# EAGLE design OXCLPC (EAGLE 9.5.2)
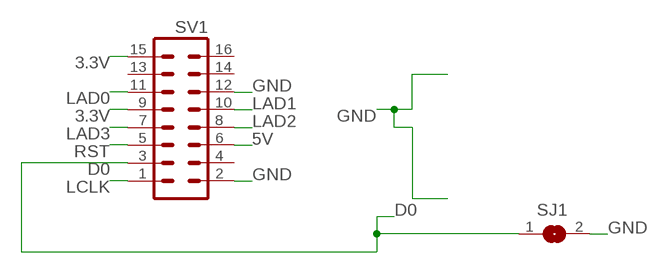
[diagram p0: schematic, sheet 1]

## Parts
SJ1  SJ  [SJ]
SV1  MA08-2  [MA08-2]

## Nets
3.3V: SV1.9 SV1.15
5V: SV1.6
D0: SJ1.1 SV1.3
GND: SJ1.2 SV1.2 SV1.12
LAD0: SV1.11
LAD1: SV1.10
LAD2: SV1.8
LAD3: SV1.7
LCLK: SV1.1
RST: SV1.5
Unconnected: SV1.4 SV1.13 SV1.14 SV1.16

## Library data of the parts
SJ1 = jumper:SJ: SMD solder JUMPER
SV1 = adapter8784:MA08-2: PIN HEADER; OC_FARNELL: unknown; OC_NEWARK: unknown

## Board
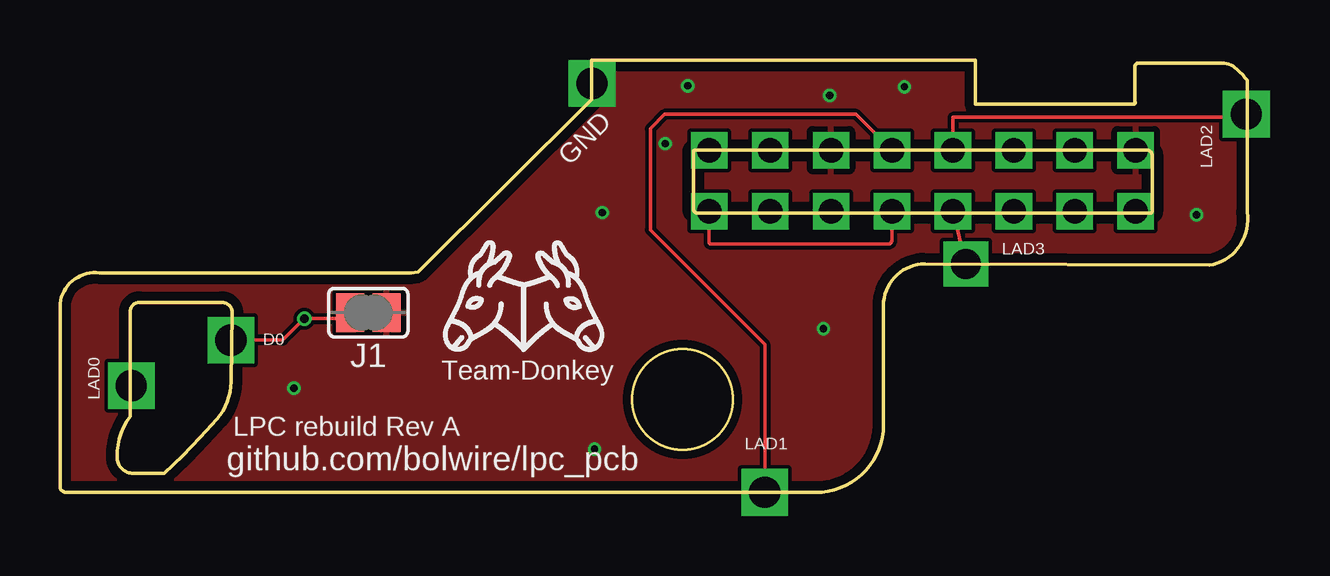
[diagram p1: board, top side]
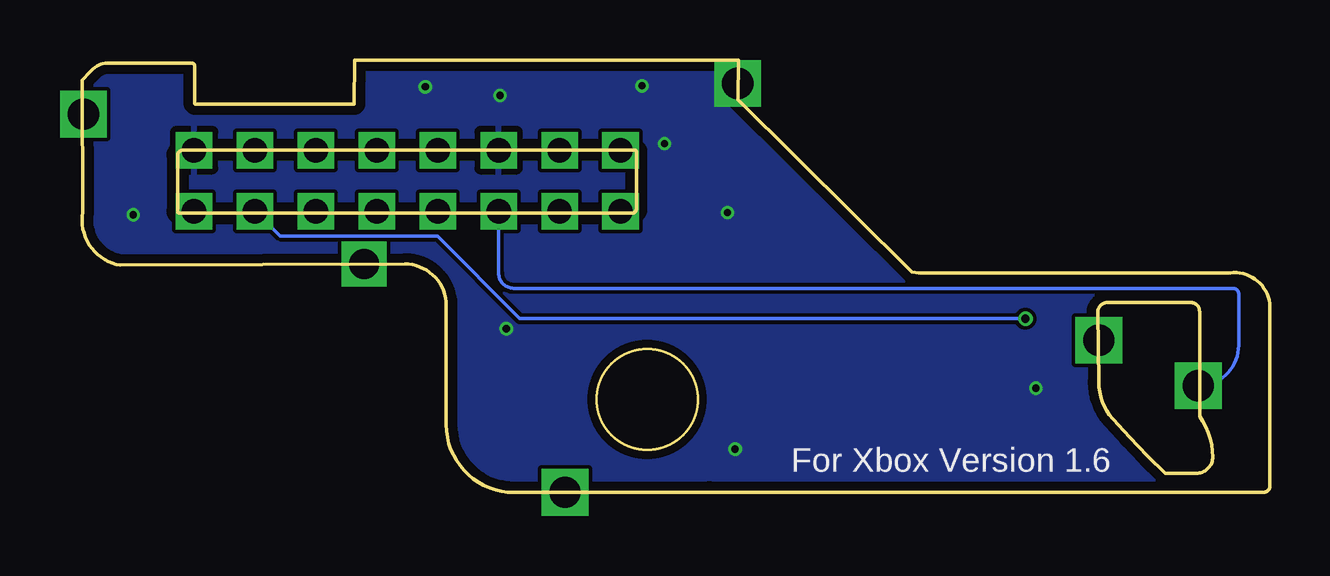
[diagram p2: board, bottom side, seen from below]

Size 49.51 x 18.04 mm. Coordinates in mm from the lower left corner, seen from the top.
Outline: 22.15,18.03 38.15,18.04 38.16,16.2 44.78,16.2 arc90 44.81,16.28 44.81,17.77 arc-90 44.95,17.91 48.54,17.91 arc-40 49.19,17.52 arc-9 49.49,17.19 49.48,11.68 arc-90 47.91,9.48 36.05,9.52 arc90 34.33,7.8 34.33,2.82 arc-90 31.5,0 26.25,0 23.37,0.01 0.32,0.01 arc-90 0,0.21 0,7.88 arc-90 1.65,9.15 14.62,9.15 14.93,9.2 22.16,16.38 22.15,18.03
Outline: 3.3,7.92 6.75,7.92 arc-90 7.18,7.5 7.12,4.6 arc-41 6.55,3.07 arc-5 4.35,0.8 3.05,0.8 arc-90 2.38,1.47 arc-36 2.92,3.17 2.92,7.55 arc-90 3.3,7.92
Outline: 26.48,14.27 45.3,14.27 arc-90 45.52,14.05 45.52,11.72 arc-90 45.45,11.65 26.57,11.65 arc-90 26.4,11.82 26.4,14.2 arc-90 26.48,14.27
Outline: circle at 25.95,3.87 radius 2.1
Copper layers (1*16): Top 0.035559375mm / dielectric 1.6mm / Bottom 0.035559375mm
Design rules "oshpark-2layer *": minimum track width 6mil, minimum drill 10mil, track to track 6mil, track to pad 6mil, pad to pad 6mil, via to via 6mil, smd to smd 6mil, copper to edge 15mil, drill to drill 6mil, minimum pad ring 5mil, minimum via ring 5mil, stop-mask expansion 2mil, vias tented up to drill 0.4mm, thermal gap 10mil

### Footprints (pad centres in the part's own frame; a part is rotated, then mirrored left to right if it is on the bottom)
SJ = smd 1.168 x 1.6: 1 -0.762,0; 2 0.762,0
MA08-2 = drill 1.016 square: 1 -8.89,-1.27; 2 -8.89,1.27; 3 -6.35,-1.27; 4 -6.35,1.27; 5 -3.81,-1.27; 6 -3.81,1.27; 7 -1.27,-1.27; 8 -1.27,1.27; 9 1.27,-1.27; 10 1.27,1.27; 11 3.81,-1.27; 12 3.81,1.27; 13 6.35,-1.27; 14 6.35,1.27; 15 8.89,-1.27; 16 8.89,1.27

### Placement (x,y rotation side)
SJ1  12.85,7.5 0 top
SV1  35.95,13 0 bottom

### Tracks (layer width: path | path; a pad name or v marks a point on that pad's centre or on a via)
3.3V
  Top 0.152: SV1.15 27.06,10.44 arc90 27.15,10.35 34.5,10.35 arc90 34.67,10.52 SV1.9 arc-90 SV1.9
D0  (via drill 0.35, 1.3)
  Top 0.152: SJ1.1 11.84,7.25 v10.18,7.25 9.29,6.35 v7.12,6.35
  Bottom 0.152: SV1.3 41.24,10.7 34.7,10.7 31.27,7.25 v10.18,7.25
GND  (via drill 0.3, 1.3)
  other vias: 32.08,16.55 31.83,6.83 22.6,11.68 22.29,1.8 9.75,4.35 47.38,11.57 25.23,14.55 26.17,16.96 35.2,16.92 22.18,17.06
  pour Top: 22.25,16.35 22.15,19.42 45.2,19.47 49.48,17.38 49.45,9.57 35.9,9.52 34.35,7.95 34.35,0.1 26.27,0.05 24.88,-1.36 0.12,-1.36 0.1,9.02 14.88,9.02 22.15,16.32
  pour Bottom: 22.12,19.7 45.62,19.72 49.83,17.47 49.9,9.43 35.92,9.43 34.35,7.87 34.35,0.1 26.32,-0.05 24.92,-1.51 -0.07,-1.51 -0.23,9.3 14.75,9.32 22.02,16.52 22,19.6
LAD0  (via drill 1.3)
  Bottom 0.152: v2.97,4.45 arc-90 1.29,6.13 1.29,8.26 arc-90 1.55,8.52 31.52,8.52 arc90 32.14,9.13 SV1.11
LAD1  (via drill 1.3)
  Top 0.152: SV1.10 33.18,15.77 25.21,15.77 24.61,15.17 24.61,10.95 29.38,6.18 v29.38,0
LAD2  (via drill 1.3)
  Top 0.152: SV1.8 37.22,15.65 49.33,15.65 v49.45,15.77
LAD3  (via drill 1.25)
  Top 0.152: SV1.7 v37.75,9.52

### Text on the board
tPlace: LAD2 | LAD3 | D0 | J1 | Team-Donkey
tNames: GND | LAD0 | LPC rebuild Rev A | LAD1 | github.com/bolwire/lpc_pcb
bNames: For Xbox Version 1.6